# EAGLE schematic fretscanner-SHIFTREG (EAGLE 6.6.0)
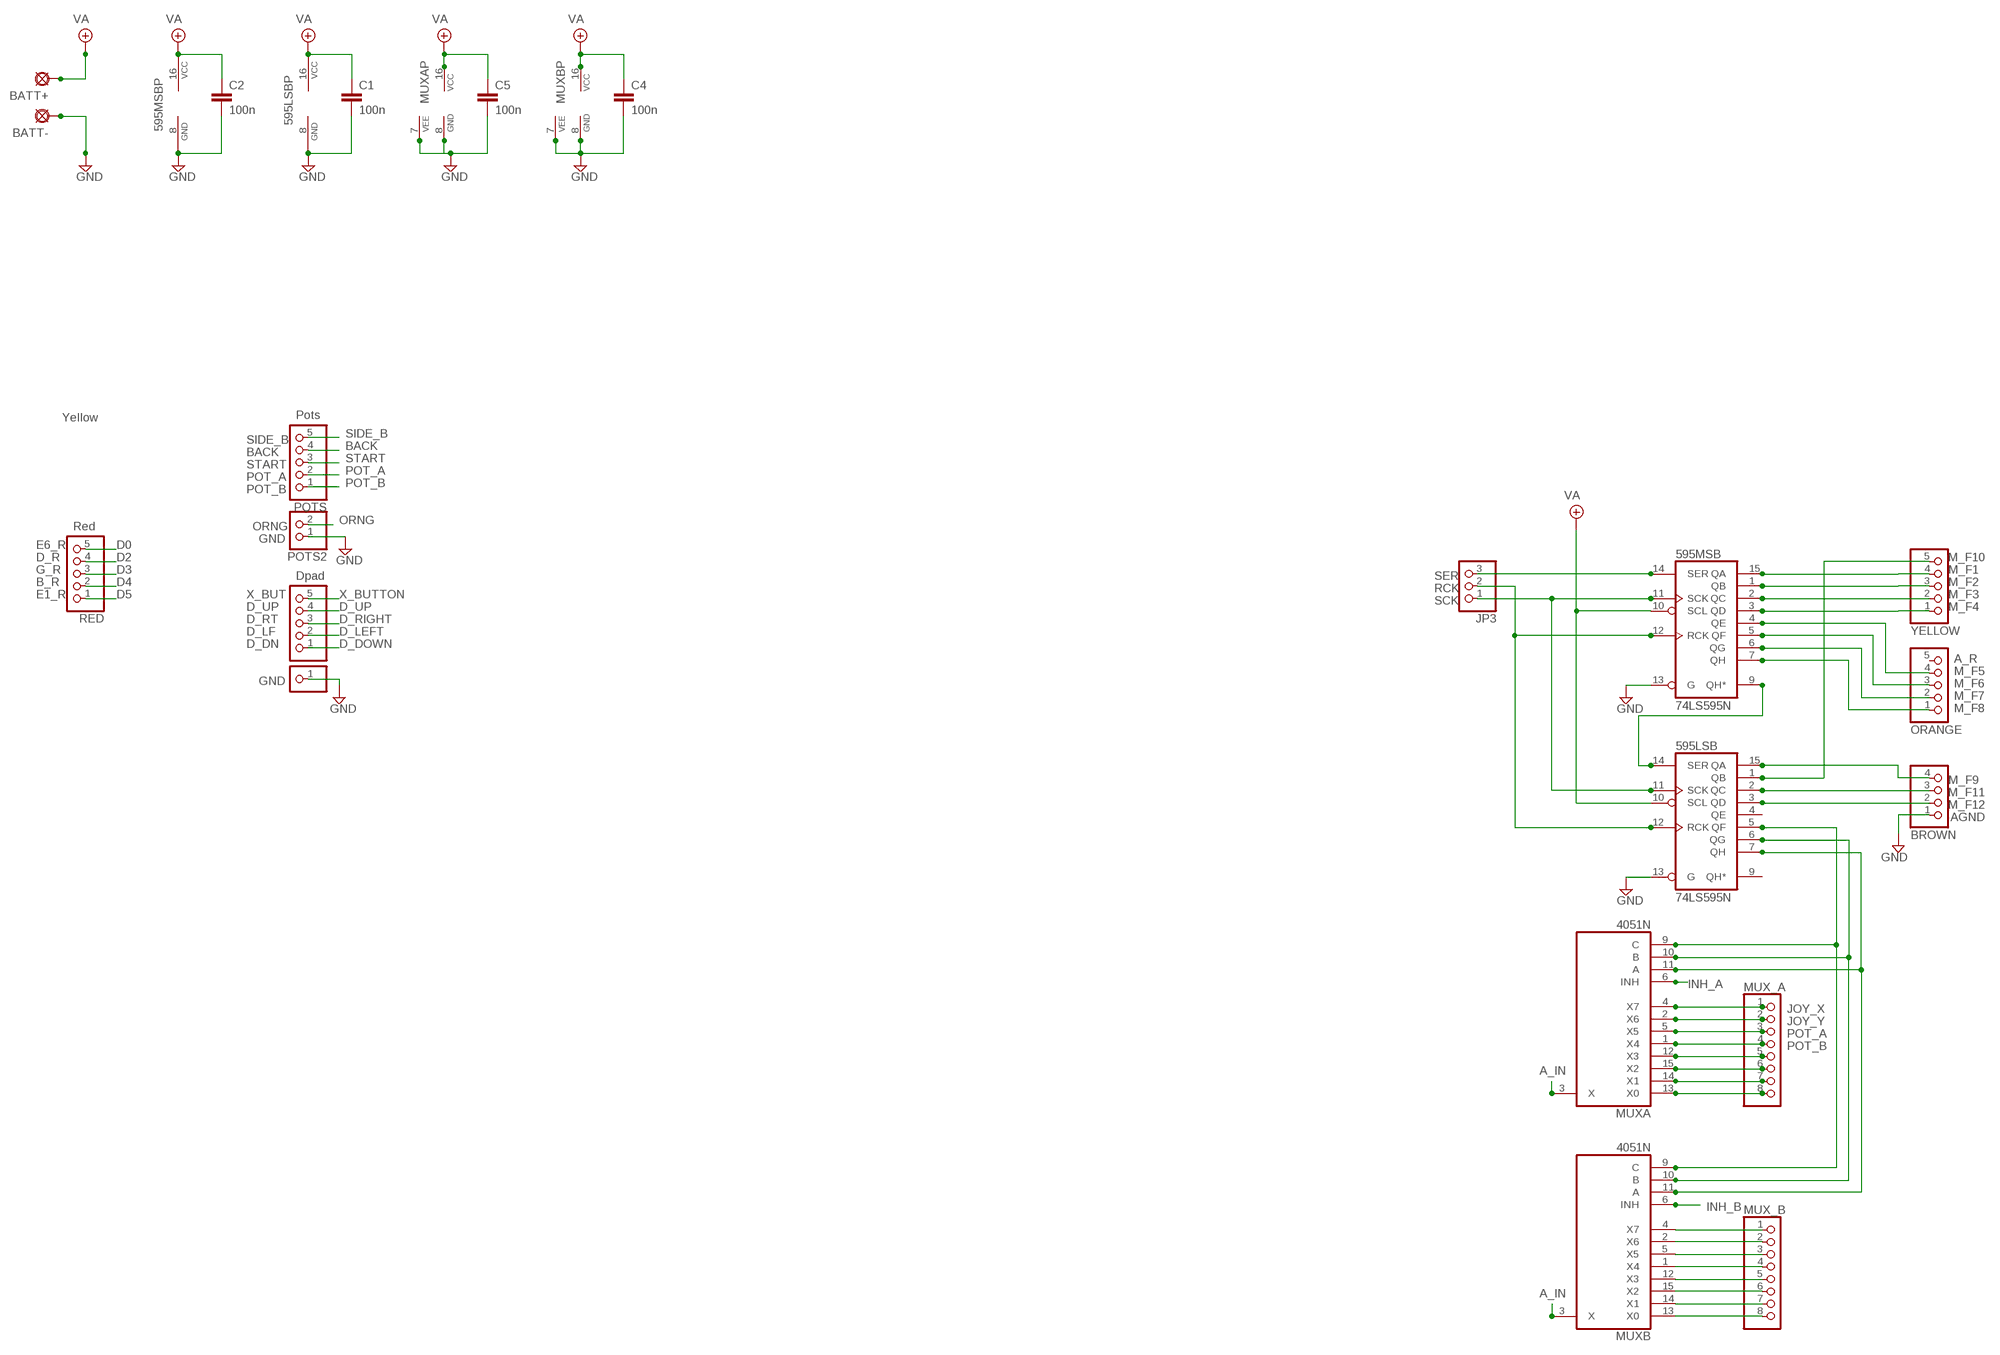
[diagram p0: schematic, sheet 1]

## Parts
595LSB  74LS595N  [DIL16]
595MSB  74LS595N  [DIL16]
BATT+  PADL  [LONG]
BATT-  PADL  [LONG]
BROWN  PINHD-1X4  [1X04]
C1  100n  050X030_050  [050X030_050_3]
C2  100n  050X030_050  [050X030_050_3]
C4  100n  050X030_050  [050X030_050_3]
C5  100n  050X030_050  [050X030_050_3]
DPAD  PINHD-1X5  [1X05]
DPAD2  PINHD-1X1  [1X01]
JP3  PINHD-1X3  [1X03]
MUX_A  PINHD-1X8  [1X08]
MUX_B  PINHD-1X8  [1X08]
MUXA  4051N  [DIL16]
MUXB  4051N  [DIL16]
ORANGE  PINHD-1X5  [1X05]
POTS  PINHD-1X5  [1X05]
POTS2  PINHD-1X2  [1X02]
RED  PINHD-1X5  [1X05]
YELLOW  PINHD-1X5  [1X05]

## Nets
A_IN: MUXA.3(X) MUXB.3(X)
BACK: POTS.4
D0: RED.5
D2: RED.4
D3: RED.3
D4: RED.2
D5: RED.1
D_DOWN: DPAD.1
D_LEFT: DPAD.2
D_RIGHT: DPAD.3
D_UP: DPAD.4
GND: 595LSB.8(GND) 595LSB.13(G) 595MSB.8(GND) 595MSB.13(G) BATT-.1(PAD) BROWN.1 C1.2 C2.2 C4.2 C5.2 DPAD2.1 MUXA.7(VEE) MUXA.8(GND) MUXB.7(VEE) MUXB.8(GND) POTS2.1
INH_A: MUXA.6(INH)
INH_B: MUXB.6(INH)
JOY_X: MUX_A.1 MUXA.4(X7)
JOY_Y: MUX_A.2 MUXA.2(X6)
MUX09: MUX_A.8 MUXA.13(X0)
N$1: 595LSB.14(SER) 595MSB.9(QH*)
N$3: MUX_A.5 MUXA.12(X3)
N$11: MUX_A.6 MUXA.15(X2)
N$13: MUX_A.7 MUXA.14(X1)
N$14: MUX_B.1 MUXB.4(X7)
N$16: MUX_B.2 MUXB.2(X6)
N$17: MUX_B.3 MUXB.5(X5)
N$19: MUX_B.4 MUXB.1(X4)
N$25: MUX_B.5 MUXB.12(X3)
N$26: MUX_B.6 MUXB.15(X2)
N$27: MUX_B.7 MUXB.14(X1)
N$28: MUX_B.8 MUXB.13(X0)
ORNG: POTS2.2
POT_A: MUX_A.3 MUXA.5(X5) POTS.2
POT_B: MUX_A.4 MUXA.1(X4) POTS.1
RCK: 595LSB.12(RCK) 595MSB.12(RCK) JP3.2
SCK: 595LSB.11(SCK) 595MSB.11(SCK) JP3.1
SER: 595MSB.14(SER) JP3.3
SIDE_B: POTS.5
SR0: 595LSB.7(QH) MUXA.11(A) MUXB.11(A)
SR1: 595LSB.6(QG) MUXA.10(B) MUXB.10(B)
SR2: 595LSB.5(QF) MUXA.9(C) MUXB.9(C)
SR4: 595LSB.3(QD) BROWN.2
SR5: 595LSB.2(QC) BROWN.3
SR6: 595LSB.1(QB) YELLOW.5
SR7: 595LSB.15(QA) BROWN.4
SR8: 595MSB.7(QH) ORANGE.1
SR9: 595MSB.6(QG) ORANGE.2
SR10: 595MSB.5(QF) ORANGE.3
SR11: 595MSB.4(QE) ORANGE.4
SR12: 595MSB.3(QD) YELLOW.1
SR13: 595MSB.2(QC) YELLOW.2
SR14: 595MSB.1(QB) YELLOW.3
SR15: 595MSB.15(QA) YELLOW.4
START: POTS.3
VA: 595LSB.10(SCL) 595LSB.16(VCC) 595MSB.10(SCL) 595MSB.16(VCC) BATT+.1(PAD) C1.1 C2.1 C4.1 C5.1 MUXA.16(VCC) MUXB.16(VCC)
X_BUTTON: DPAD.5
Unconnected: 595LSB.4(QE) 595LSB.9(QH*) ORANGE.5

## Notes on the sheet
- Yellow
- Pots
- SIDE_B
- BACK
- START
- POT_A
- POT_B
- Red | ORNG
- GND
- E6_R
- D_R | M_F10
- G_R | M_F1
- Dpad
- B_R | M_F2
- E1_R | X_BUT | M_F3
- D_UP | M_F4
- D_RT
- D_LF
- D_DN
- A_R
- M_F5
- M_F6
- GND
- M_F7
- M_F8
- M_F9
- M_F11
- M_F12
- AGND

## Library data of the parts
595LSB 595MSB = 74xx-us:74*595: 8-bit SHIFT REGISTER, output latch
BATT+ BATT- = gm-supply:PAD: PAD use this package for pads with any purpose, including input, output, send or return various pad shapes: round, square, octogonal, long, and long offset
BROWN = pinhead:PINHD-1X4: PIN HEADER
C1 C2 C4 C5 = gm-caps-ceramic:050X030_050: 120 - 150pF Xicon Ceramic Disc 5mm lead spacing
DPAD ORANGE POTS RED YELLOW = pinhead:PINHD-1X5: PIN HEADER
DPAD2 = pinhead:PINHD-1X1: PIN HEADER
JP3 = pinhead:PINHD-1X3: PIN HEADER
MUX_A MUX_B = pinhead:PINHD-1X8: PIN HEADER
MUXA MUXB = 40xx:4051: 8-channel ANALOG MULTIPLEXER
POTS2 = pinhead:PINHD-1X2: PIN HEADER